# Altium schematic sheet BCK_REVA_2.SchDoc
size A4; SheetNumber: 2; SheetTotal: 3
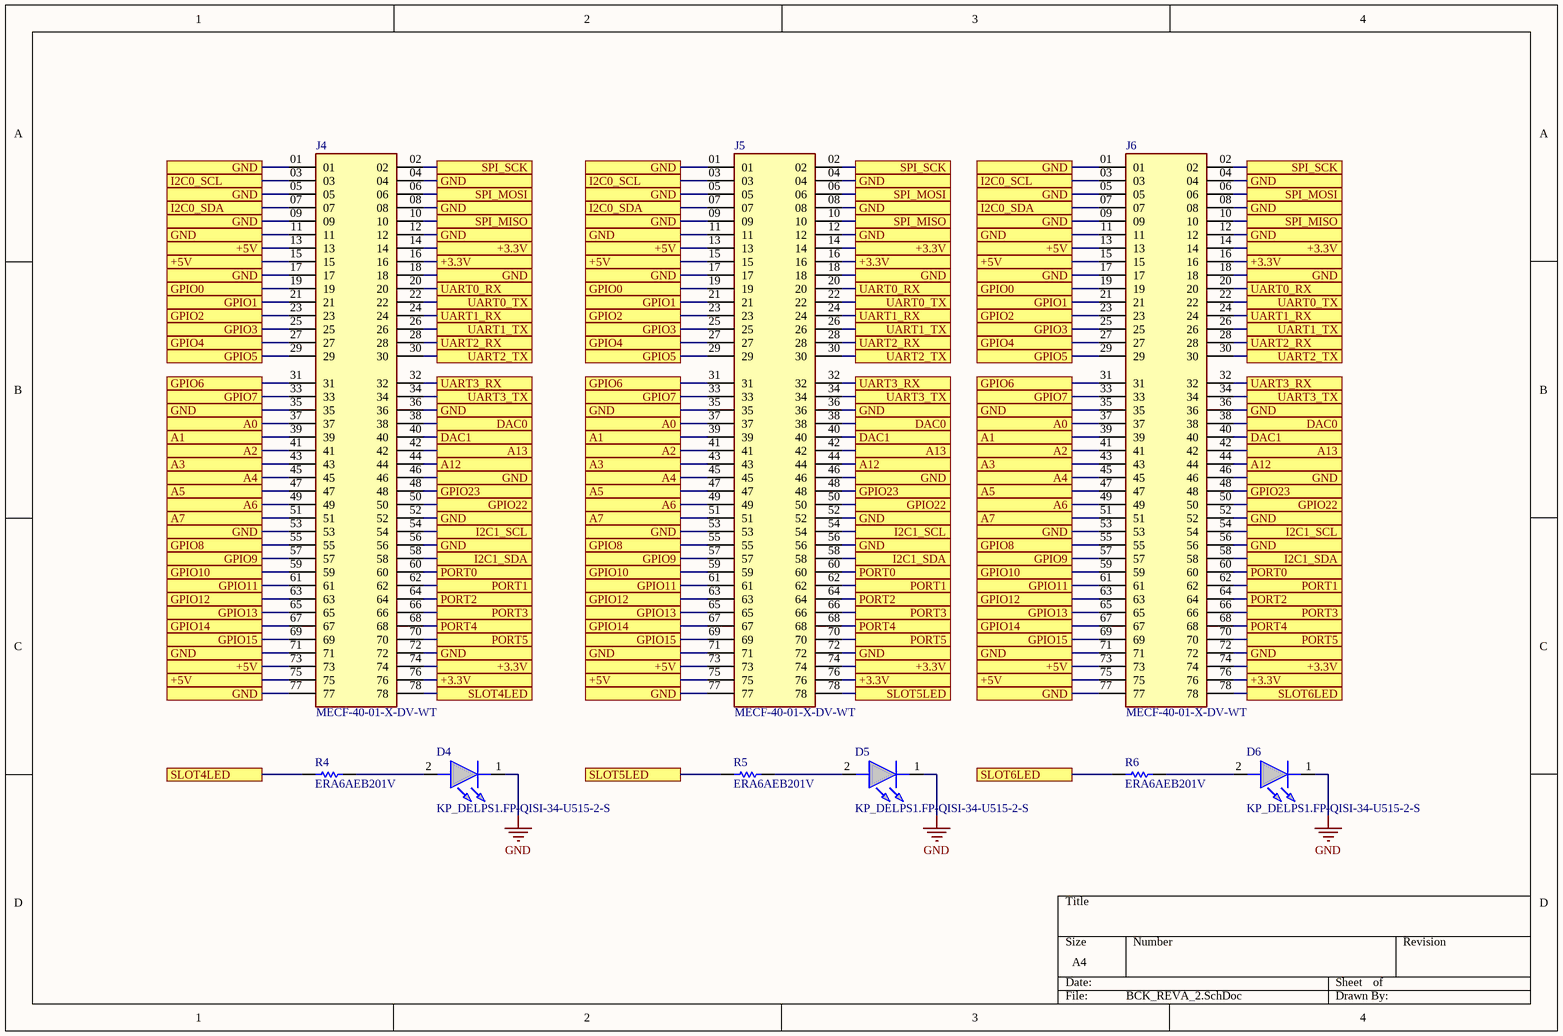
[diagram p0: BCK_REVA_2.SchDoc]

## Parts
D4  KP_DELPS1.FP-QISI-34-U515-2-S  [KPDELPS1FPQISI34U5152S]
D5  KP_DELPS1.FP-QISI-34-U515-2-S  [KPDELPS1FPQISI34U5152S]
D6  KP_DELPS1.FP-QISI-34-U515-2-S  [KPDELPS1FPQISI34U5152S]
J4  MECF-40-01-X-DV-WT  [SAMTEC_MECF-40-01-X-DV-WT]
J5  MECF-40-01-X-DV-WT  [SAMTEC_MECF-40-01-X-DV-WT]
J6  MECF-40-01-X-DV-WT  [SAMTEC_MECF-40-01-X-DV-WT]
R4  ERA6AEB201V  [RESC2013X60X40NL20T25]
R5  ERA6AEB201V  [RESC2013X60X40NL20T25]
R6  ERA6AEB201V  [RESC2013X60X40NL20T25]

## Ports
+3.3V (see BCK_REVA[2A], BCK_REVA[2B], BCK_REVA[2C], BCK_REVA[3A], BCK_REVA[3B], BCK_REVA[3C], BCK_REVA[4A], BCK_REVA[4B], BCK_REVA[4C], BCK_REVA_2[2A], BCK_REVA_2[2B], BCK_REVA_2[2C], BCK_REVA_2[3A], BCK_REVA_2[3B], BCK_REVA_2[3C], BCK_REVA_2[4A], BCK_REVA_2[4B], BCK_REVA_2[4C], BCK_REVA_3[2A], BCK_REVA_3[2B], BCK_REVA_3[2C], BCK_REVA_3[3A], BCK_REVA_3[3B], BCK_REVA_3[3C], BCK_REVA_3[4A], BCK_REVA_3[4B], BCK_REVA_3[4C]), +3.3V (see BCK_REVA[2A], BCK_REVA[2B], BCK_REVA[2C], BCK_REVA[3A], BCK_REVA[3B], BCK_REVA[3C], BCK_REVA[4A], BCK_REVA[4B], BCK_REVA[4C], BCK_REVA_2[2A], BCK_REVA_2[2B], BCK_REVA_2[2C], BCK_REVA_2[3A], BCK_REVA_2[3B], BCK_REVA_2[3C], BCK_REVA_2[4A], BCK_REVA_2[4C], BCK_REVA_3[2A], BCK_REVA_3[2B], BCK_REVA_3[2C], BCK_REVA_3[3A], BCK_REVA_3[3B], BCK_REVA_3[3C], BCK_REVA_3[4A], BCK_REVA_3[4B], BCK_REVA_3[4C]), +3.3V (see BCK_REVA[2A], BCK_REVA[2B], BCK_REVA[2C], BCK_REVA[3A], BCK_REVA[3B], BCK_REVA[3C], BCK_REVA[4A], BCK_REVA[4B], BCK_REVA[4C], BCK_REVA_2[2A], BCK_REVA_2[2B], BCK_REVA_2[2C], BCK_REVA_2[3A], BCK_REVA_2[3B], BCK_REVA_2[3C], BCK_REVA_2[4B], BCK_REVA_2[4C], BCK_REVA_3[2A], BCK_REVA_3[2B], BCK_REVA_3[2C], BCK_REVA_3[3A], BCK_REVA_3[3B], BCK_REVA_3[3C], BCK_REVA_3[4A], BCK_REVA_3[4B], BCK_REVA_3[4C]), +3.3V (see BCK_REVA[2A], BCK_REVA[2B], BCK_REVA[2C], BCK_REVA[3A], BCK_REVA[3B], BCK_REVA[3C], BCK_REVA[4A], BCK_REVA[4B], BCK_REVA[4C], BCK_REVA_2[2A], BCK_REVA_2[2B], BCK_REVA_2[2C], BCK_REVA_2[3A], BCK_REVA_2[3C], BCK_REVA_2[4A], BCK_REVA_2[4B], BCK_REVA_2[4C], BCK_REVA_3[2A], BCK_REVA_3[2B], BCK_REVA_3[2C], BCK_REVA_3[3A], BCK_REVA_3[3B], BCK_REVA_3[3C], BCK_REVA_3[4A], BCK_REVA_3[4B], BCK_REVA_3[4C]), +3.3V (see BCK_REVA[2A], BCK_REVA[2B], BCK_REVA[2C], BCK_REVA[3A], BCK_REVA[3B], BCK_REVA[3C], BCK_REVA[4A], BCK_REVA[4B], BCK_REVA[4C], BCK_REVA_2[2A], BCK_REVA_2[2B], BCK_REVA_2[2C], BCK_REVA_2[3B], BCK_REVA_2[3C], BCK_REVA_2[4A], BCK_REVA_2[4B], BCK_REVA_2[4C], BCK_REVA_3[2A], BCK_REVA_3[2B], BCK_REVA_3[2C], BCK_REVA_3[3A], BCK_REVA_3[3B], BCK_REVA_3[3C], BCK_REVA_3[4A], BCK_REVA_3[4B], BCK_REVA_3[4C]), +3.3V (see BCK_REVA[2A], BCK_REVA[2B], BCK_REVA[2C], BCK_REVA[3A], BCK_REVA[3B], BCK_REVA[3C], BCK_REVA[4A], BCK_REVA[4B], BCK_REVA[4C], BCK_REVA_2[2A], BCK_REVA_2[2C], BCK_REVA_2[3A], BCK_REVA_2[3B], BCK_REVA_2[3C], BCK_REVA_2[4A], BCK_REVA_2[4B], BCK_REVA_2[4C], BCK_REVA_3[2A], BCK_REVA_3[2B], BCK_REVA_3[2C], BCK_REVA_3[3A], BCK_REVA_3[3B], BCK_REVA_3[3C], BCK_REVA_3[4A], BCK_REVA_3[4B], BCK_REVA_3[4C]), +3.3V (see BCK_REVA[2A], BCK_REVA[2B], BCK_REVA[2C], BCK_REVA[3A], BCK_REVA[3B], BCK_REVA[3C], BCK_REVA[4A], BCK_REVA[4B], BCK_REVA[4C], BCK_REVA_2[2B], BCK_REVA_2[2C], BCK_REVA_2[3A], BCK_REVA_2[3B], BCK_REVA_2[3C], BCK_REVA_2[4A], BCK_REVA_2[4B], BCK_REVA_2[4C], BCK_REVA_3[2A], BCK_REVA_3[2B], BCK_REVA_3[2C], BCK_REVA_3[3A], BCK_REVA_3[3B], BCK_REVA_3[3C], BCK_REVA_3[4A], BCK_REVA_3[4B], BCK_REVA_3[4C]), +5V (see BCK_REVA[1A], BCK_REVA[1B], BCK_REVA[1C], BCK_REVA[2A], BCK_REVA[2B], BCK_REVA[2C], BCK_REVA[3A], BCK_REVA[3B], BCK_REVA[3C], BCK_REVA_2[1A], BCK_REVA_2[1B], BCK_REVA_2[1C], BCK_REVA_2[2A], BCK_REVA_2[2B], BCK_REVA_2[2C], BCK_REVA_2[3A], BCK_REVA_2[3B], BCK_REVA_2[3C], BCK_REVA_3[1A], BCK_REVA_3[1B], BCK_REVA_3[1C], BCK_REVA_3[2A], BCK_REVA_3[2B], BCK_REVA_3[2C], BCK_REVA_3[3A], BCK_REVA_3[3B], BCK_REVA_3[3C]), +5V (see BCK_REVA[1A], BCK_REVA[1B], BCK_REVA[1C], BCK_REVA[2A], BCK_REVA[2B], BCK_REVA[2C], BCK_REVA[3A], BCK_REVA[3B], BCK_REVA[3C], BCK_REVA_2[1A], BCK_REVA_2[1B], BCK_REVA_2[1C], BCK_REVA_2[2A], BCK_REVA_2[2B], BCK_REVA_2[2C], BCK_REVA_2[3A], BCK_REVA_2[3C], BCK_REVA_3[1A], BCK_REVA_3[1B], BCK_REVA_3[1C], BCK_REVA_3[2A], BCK_REVA_3[2B], BCK_REVA_3[2C], BCK_REVA_3[3A], BCK_REVA_3[3B], BCK_REVA_3[3C]), +5V (see BCK_REVA[1A], BCK_REVA[1B], BCK_REVA[1C], BCK_REVA[2A], BCK_REVA[2B], BCK_REVA[2C], BCK_REVA[3A], BCK_REVA[3B], BCK_REVA[3C], BCK_REVA_2[1A], BCK_REVA_2[1B], BCK_REVA_2[1C], BCK_REVA_2[2A], BCK_REVA_2[2B], BCK_REVA_2[2C], BCK_REVA_2[3B], BCK_REVA_2[3C], BCK_REVA_3[1A], BCK_REVA_3[1B], BCK_REVA_3[1C], BCK_REVA_3[2A], BCK_REVA_3[2B], BCK_REVA_3[2C], BCK_REVA_3[3A], BCK_REVA_3[3B], BCK_REVA_3[3C]), +5V (see BCK_REVA[1A], BCK_REVA[1B], BCK_REVA[1C], BCK_REVA[2A], BCK_REVA[2B], BCK_REVA[2C], BCK_REVA[3A], BCK_REVA[3B], BCK_REVA[3C], BCK_REVA_2[1A], BCK_REVA_2[1B], BCK_REVA_2[1C], BCK_REVA_2[2A], BCK_REVA_2[2C], BCK_REVA_2[3A], BCK_REVA_2[3B], BCK_REVA_2[3C], BCK_REVA_3[1A], BCK_REVA_3[1B], BCK_REVA_3[1C], BCK_REVA_3[2A], BCK_REVA_3[2B], BCK_REVA_3[2C], BCK_REVA_3[3A], BCK_REVA_3[3B], BCK_REVA_3[3C]), +5V (see BCK_REVA[1A], BCK_REVA[1B], BCK_REVA[1C], BCK_REVA[2A], BCK_REVA[2B], BCK_REVA[2C], BCK_REVA[3A], BCK_REVA[3B], BCK_REVA[3C], BCK_REVA_2[1A], BCK_REVA_2[1B], BCK_REVA_2[1C], BCK_REVA_2[2B], BCK_REVA_2[2C], BCK_REVA_2[3A], BCK_REVA_2[3B], BCK_REVA_2[3C], BCK_REVA_3[1A], BCK_REVA_3[1B], BCK_REVA_3[1C], BCK_REVA_3[2A], BCK_REVA_3[2B], BCK_REVA_3[2C], BCK_REVA_3[3A], BCK_REVA_3[3B], BCK_REVA_3[3C]), +5V (see BCK_REVA[1A], BCK_REVA[1B], BCK_REVA[1C], BCK_REVA[2A], BCK_REVA[2B], BCK_REVA[2C], BCK_REVA[3A], BCK_REVA[3B], BCK_REVA[3C], BCK_REVA_2[1A], BCK_REVA_2[1C], BCK_REVA_2[2A], BCK_REVA_2[2B], BCK_REVA_2[2C], BCK_REVA_2[3A], BCK_REVA_2[3B], BCK_REVA_2[3C], BCK_REVA_3[1A], BCK_REVA_3[1B], BCK_REVA_3[1C], BCK_REVA_3[2A], BCK_REVA_3[2B], BCK_REVA_3[2C], BCK_REVA_3[3A], BCK_REVA_3[3B], BCK_REVA_3[3C]), +5V (see BCK_REVA[1A], BCK_REVA[1B], BCK_REVA[1C], BCK_REVA[2A], BCK_REVA[2B], BCK_REVA[2C], BCK_REVA[3A], BCK_REVA[3B], BCK_REVA[3C], BCK_REVA_2[1B], BCK_REVA_2[1C], BCK_REVA_2[2A], BCK_REVA_2[2B], BCK_REVA_2[2C], BCK_REVA_2[3A], BCK_REVA_2[3B], BCK_REVA_2[3C], BCK_REVA_3[1A], BCK_REVA_3[1B], BCK_REVA_3[1C], BCK_REVA_3[2A], BCK_REVA_3[2B], BCK_REVA_3[2C], BCK_REVA_3[3A], BCK_REVA_3[3B], BCK_REVA_3[3C]), A0 (see BCK_REVA[1B], BCK_REVA[2B], BCK_REVA[3B], BCK_REVA_2[1B], BCK_REVA_2[2B], BCK_REVA_3[1B], BCK_REVA_3[2B], BCK_REVA_3[3B]), A0 (see BCK_REVA[1B], BCK_REVA[2B], BCK_REVA[3B], BCK_REVA_2[1B], BCK_REVA_2[3B], BCK_REVA_3[1B], BCK_REVA_3[2B], BCK_REVA_3[3B]), A0 (see BCK_REVA[1B], BCK_REVA[2B], BCK_REVA[3B], BCK_REVA_2[2B], BCK_REVA_2[3B], BCK_REVA_3[1B], BCK_REVA_3[2B], BCK_REVA_3[3B]), A1 (see BCK_REVA[1B], BCK_REVA[2B], BCK_REVA[3B], BCK_REVA_2[1B], BCK_REVA_2[2B], BCK_REVA_3[1B], BCK_REVA_3[2B], BCK_REVA_3[3B]), A1 (see BCK_REVA[1B], BCK_REVA[2B], BCK_REVA[3B], BCK_REVA_2[1B], BCK_REVA_2[3B], BCK_REVA_3[1B], BCK_REVA_3[2B], BCK_REVA_3[3B]), A1 (see BCK_REVA[1B], BCK_REVA[2B], BCK_REVA[3B], BCK_REVA_2[2B], BCK_REVA_2[3B], BCK_REVA_3[1B], BCK_REVA_3[2B], BCK_REVA_3[3B]), A2 (see BCK_REVA[1B], BCK_REVA[2B], BCK_REVA[3B], BCK_REVA_2[1B], BCK_REVA_2[2B], BCK_REVA_3[1B], BCK_REVA_3[2B], BCK_REVA_3[3B]), A2 (see BCK_REVA[1B], BCK_REVA[2B], BCK_REVA[3B], BCK_REVA_2[1B], BCK_REVA_2[3B], BCK_REVA_3[1B], BCK_REVA_3[2B], BCK_REVA_3[3B]), A2 (see BCK_REVA[1B], BCK_REVA[2B], BCK_REVA[3B], BCK_REVA_2[2B], BCK_REVA_2[3B], BCK_REVA_3[1B], BCK_REVA_3[2B], BCK_REVA_3[3B]), A3 (see BCK_REVA[1B], BCK_REVA[2B], BCK_REVA[3B], BCK_REVA_2[1B], BCK_REVA_2[2B], BCK_REVA_3[1B], BCK_REVA_3[2B], BCK_REVA_3[3B]), A3 (see BCK_REVA[1B], BCK_REVA[2B], BCK_REVA[3B], BCK_REVA_2[1B], BCK_REVA_2[3B], BCK_REVA_3[1B], BCK_REVA_3[2B], BCK_REVA_3[3B]), A3 (see BCK_REVA[1B], BCK_REVA[2B], BCK_REVA[3B], BCK_REVA_2[2B], BCK_REVA_2[3B], BCK_REVA_3[1B], BCK_REVA_3[2B], BCK_REVA_3[3B]), A4 (see BCK_REVA[1B], BCK_REVA[2B], BCK_REVA[3B], BCK_REVA_2[1B], BCK_REVA_2[2B], BCK_REVA_3[1B], BCK_REVA_3[2B], BCK_REVA_3[3B]), A4 (see BCK_REVA[1B], BCK_REVA[2B], BCK_REVA[3B], BCK_REVA_2[1B], BCK_REVA_2[3B], BCK_REVA_3[1B], BCK_REVA_3[2B], BCK_REVA_3[3B]), A4 (see BCK_REVA[1B], BCK_REVA[2B], BCK_REVA[3B], BCK_REVA_2[2B], BCK_REVA_2[3B], BCK_REVA_3[1B], BCK_REVA_3[2B], BCK_REVA_3[3B]), A5 (see BCK_REVA[1B], BCK_REVA[2B], BCK_REVA[3B], BCK_REVA_2[1B], BCK_REVA_2[2B], BCK_REVA_3[1B], BCK_REVA_3[2B], BCK_REVA_3[3B]), A5 (see BCK_REVA[1B], BCK_REVA[2B], BCK_REVA[3B], BCK_REVA_2[1B], BCK_REVA_2[3B], BCK_REVA_3[1B], BCK_REVA_3[2B], BCK_REVA_3[3B]), A5 (see BCK_REVA[1B], BCK_REVA[2B], BCK_REVA[3B], BCK_REVA_2[2B], BCK_REVA_2[3B], BCK_REVA_3[1B], BCK_REVA_3[2B], BCK_REVA_3[3B]), A6 (see BCK_REVA[1B], BCK_REVA[2B], BCK_REVA[3B], BCK_REVA_2[1B], BCK_REVA_2[2B], BCK_REVA_3[1B], BCK_REVA_3[2B], BCK_REVA_3[3B]), A6 (see BCK_REVA[1B], BCK_REVA[2B], BCK_REVA[3B], BCK_REVA_2[1B], BCK_REVA_2[3B], BCK_REVA_3[1B], BCK_REVA_3[2B], BCK_REVA_3[3B]), A6 (see BCK_REVA[1B], BCK_REVA[2B], BCK_REVA[3B], BCK_REVA_2[2B], BCK_REVA_2[3B], BCK_REVA_3[1B], BCK_REVA_3[2B], BCK_REVA_3[3B]), A7 (see BCK_REVA[1C], BCK_REVA[2C], BCK_REVA[3C], BCK_REVA_2[1C], BCK_REVA_2[2C], BCK_REVA_3[1C], BCK_REVA_3[2C], BCK_REVA_3[3C]), A7 (see BCK_REVA[1C], BCK_REVA[2C], BCK_REVA[3C], BCK_REVA_2[1C], BCK_REVA_2[3C], BCK_REVA_3[1C], BCK_REVA_3[2C], BCK_REVA_3[3C]), A7 (see BCK_REVA[1C], BCK_REVA[2C], BCK_REVA[3C], BCK_REVA_2[2C], BCK_REVA_2[3C], BCK_REVA_3[1C], BCK_REVA_3[2C], BCK_REVA_3[3C]), A12 (see BCK_REVA[2B], BCK_REVA[3B], BCK_REVA[4B], BCK_REVA_2[2B], BCK_REVA_2[3B], BCK_REVA_3[2B], BCK_REVA_3[3B], BCK_REVA_3[4B]), A12 (see BCK_REVA[2B], BCK_REVA[3B], BCK_REVA[4B], BCK_REVA_2[2B], BCK_REVA_2[4B], BCK_REVA_3[2B], BCK_REVA_3[3B], BCK_REVA_3[4B]), A12 (see BCK_REVA[2B], BCK_REVA[3B], BCK_REVA[4B], BCK_REVA_2[3B], BCK_REVA_2[4B], BCK_REVA_3[2B], BCK_REVA_3[3B], BCK_REVA_3[4B]), A13 (see BCK_REVA[2B], BCK_REVA[3B], BCK_REVA[4B], BCK_REVA_2[2B], BCK_REVA_2[3B], BCK_REVA_3[2B], BCK_REVA_3[3B], BCK_REVA_3[4B]), A13 (see BCK_REVA[2B], BCK_REVA[3B], BCK_REVA[4B], BCK_REVA_2[2B], BCK_REVA_2[4B], BCK_REVA_3[2B], BCK_REVA_3[3B], BCK_REVA_3[4B]), A13 (see BCK_REVA[2B], BCK_REVA[3B], BCK_REVA[4B], BCK_REVA_2[3B], BCK_REVA_2[4B], BCK_REVA_3[2B], BCK_REVA_3[3B], BCK_REVA_3[4B]), DAC0 (see BCK_REVA[2B], BCK_REVA[3B], BCK_REVA[4B], BCK_REVA_2[2B], BCK_REVA_2[3B], BCK_REVA_3[2B], BCK_REVA_3[3B], BCK_REVA_3[4B]), DAC0 (see BCK_REVA[2B], BCK_REVA[3B], BCK_REVA[4B], BCK_REVA_2[2B], BCK_REVA_2[4B], BCK_REVA_3[2B], BCK_REVA_3[3B], BCK_REVA_3[4B]), DAC0 (see BCK_REVA[2B], BCK_REVA[3B], BCK_REVA[4B], BCK_REVA_2[3B], BCK_REVA_2[4B], BCK_REVA_3[2B], BCK_REVA_3[3B], BCK_REVA_3[4B]), DAC1 (see BCK_REVA[2B], BCK_REVA[3B], BCK_REVA[4B], BCK_REVA_2[2B], BCK_REVA_2[3B], BCK_REVA_3[2B], BCK_REVA_3[3B], BCK_REVA_3[4B]), DAC1 (see BCK_REVA[2B], BCK_REVA[3B], BCK_REVA[4B], BCK_REVA_2[2B], BCK_REVA_2[4B], BCK_REVA_3[2B], BCK_REVA_3[3B], BCK_REVA_3[4B]), DAC1 (see BCK_REVA[2B], BCK_REVA[3B], BCK_REVA[4B], BCK_REVA_2[3B], BCK_REVA_2[4B], BCK_REVA_3[2B], BCK_REVA_3[3B], BCK_REVA_3[4B]), GND (see BCK_REVA[1A], BCK_REVA[1B], BCK_REVA[1C], BCK_REVA[1D], BCK_REVA[2A], BCK_REVA[2B], BCK_REVA[2C], BCK_REVA[3A], BCK_REVA[3B], BCK_REVA[3C], BCK_REVA[4A], BCK_REVA[4B], BCK_REVA[4C], BCK_REVA_2[1A], BCK_REVA_2[1B], BCK_REVA_2[1C], BCK_REVA_2[2A], BCK_REVA_2[2B], BCK_REVA_2[2C], BCK_REVA_2[3A], BCK_REVA_2[3B], BCK_REVA_2[3C], BCK_REVA_2[4A], BCK_REVA_2[4B], BCK_REVA_2[4C], BCK_REVA_3[1A], BCK_REVA_3[1B], BCK_REVA_3[1C], BCK_REVA_3[2A], BCK_REVA_3[2B], BCK_REVA_3[2C], BCK_REVA_3[3A], BCK_REVA_3[3B], BCK_REVA_3[3C], BCK_REVA_3[4A], BCK_REVA_3[4B], BCK_REVA_3[4C]), GPIO0 (see BCK_REVA[1B], BCK_REVA[2B], BCK_REVA[3B], BCK_REVA_2[1B], BCK_REVA_2[2B], BCK_REVA_3[1B], BCK_REVA_3[2B], BCK_REVA_3[3B]), GPIO0 (see BCK_REVA[1B], BCK_REVA[2B], BCK_REVA[3B], BCK_REVA_2[1B], BCK_REVA_2[3B], BCK_REVA_3[1B], BCK_REVA_3[2B], BCK_REVA_3[3B]), GPIO0 (see BCK_REVA[1B], BCK_REVA[2B], BCK_REVA[3B], BCK_REVA_2[2B], BCK_REVA_2[3B], BCK_REVA_3[1B], BCK_REVA_3[2B], BCK_REVA_3[3B]), GPIO1 (see BCK_REVA[1B], BCK_REVA[2B], BCK_REVA[3B], BCK_REVA_2[1B], BCK_REVA_2[2B], BCK_REVA_3[1B], BCK_REVA_3[2B], BCK_REVA_3[3B]), GPIO1 (see BCK_REVA[1B], BCK_REVA[2B], BCK_REVA[3B], BCK_REVA_2[1B], BCK_REVA_2[3B], BCK_REVA_3[1B], BCK_REVA_3[2B], BCK_REVA_3[3B]), GPIO1 (see BCK_REVA[1B], BCK_REVA[2B], BCK_REVA[3B], BCK_REVA_2[2B], BCK_REVA_2[3B], BCK_REVA_3[1B], BCK_REVA_3[2B], BCK_REVA_3[3B]), GPIO2 (see BCK_REVA[1B], BCK_REVA[2B], BCK_REVA[3B], BCK_REVA_2[1B], BCK_REVA_2[2B], BCK_REVA_3[1B], BCK_REVA_3[2B], BCK_REVA_3[3B]), GPIO2 (see BCK_REVA[1B], BCK_REVA[2B], BCK_REVA[3B], BCK_REVA_2[1B], BCK_REVA_2[3B], BCK_REVA_3[1B], BCK_REVA_3[2B], BCK_REVA_3[3B]), GPIO2 (see BCK_REVA[1B], BCK_REVA[2B], BCK_REVA[3B], BCK_REVA_2[2B], BCK_REVA_2[3B], BCK_REVA_3[1B], BCK_REVA_3[2B], BCK_REVA_3[3B]), GPIO3 (see BCK_REVA[1B], BCK_REVA[2B], BCK_REVA[3B], BCK_REVA_2[1B], BCK_REVA_2[2B], BCK_REVA_3[1B], BCK_REVA_3[2B], BCK_REVA_3[3B]), GPIO3 (see BCK_REVA[1B], BCK_REVA[2B], BCK_REVA[3B], BCK_REVA_2[1B], BCK_REVA_2[3B], BCK_REVA_3[1B], BCK_REVA_3[2B], BCK_REVA_3[3B]), GPIO3 (see BCK_REVA[1B], BCK_REVA[2B], BCK_REVA[3B], BCK_REVA_2[2B], BCK_REVA_2[3B], BCK_REVA_3[1B], BCK_REVA_3[2B], BCK_REVA_3[3B]), GPIO4 (see BCK_REVA[1B], BCK_REVA[2B], BCK_REVA[3B], BCK_REVA_2[1B], BCK_REVA_2[2B], BCK_REVA_3[1B], BCK_REVA_3[2B], BCK_REVA_3[3B]), GPIO4 (see BCK_REVA[1B], BCK_REVA[2B], BCK_REVA[3B], BCK_REVA_2[1B], BCK_REVA_2[3B], BCK_REVA_3[1B], BCK_REVA_3[2B], BCK_REVA_3[3B]), GPIO4 (see BCK_REVA[1B], BCK_REVA[2B], BCK_REVA[3B], BCK_REVA_2[2B], BCK_REVA_2[3B], BCK_REVA_3[1B], BCK_REVA_3[2B], BCK_REVA_3[3B]), GPIO5 (see BCK_REVA[1B], BCK_REVA[2B], BCK_REVA[3B], BCK_REVA_2[1B], BCK_REVA_2[2B], BCK_REVA_3[1B], BCK_REVA_3[2B], BCK_REVA_3[3B]), GPIO5 (see BCK_REVA[1B], BCK_REVA[2B], BCK_REVA[3B], BCK_REVA_2[1B], BCK_REVA_2[3B], BCK_REVA_3[1B], BCK_REVA_3[2B], BCK_REVA_3[3B]), GPIO5 (see BCK_REVA[1B], BCK_REVA[2B], BCK_REVA[3B], BCK_REVA_2[2B], BCK_REVA_2[3B], BCK_REVA_3[1B], BCK_REVA_3[2B], BCK_REVA_3[3B]), GPIO6 (see BCK_REVA[1B], BCK_REVA[2B], BCK_REVA[3B], BCK_REVA_2[1B], BCK_REVA_2[2B], BCK_REVA_3[1B], BCK_REVA_3[2B], BCK_REVA_3[3B]), GPIO6 (see BCK_REVA[1B], BCK_REVA[2B], BCK_REVA[3B], BCK_REVA_2[1B], BCK_REVA_2[3B], BCK_REVA_3[1B], BCK_REVA_3[2B], BCK_REVA_3[3B]), GPIO6 (see BCK_REVA[1B], BCK_REVA[2B], BCK_REVA[3B], BCK_REVA_2[2B], BCK_REVA_2[3B], BCK_REVA_3[1B], BCK_REVA_3[2B], BCK_REVA_3[3B]), GPIO7 (see BCK_REVA[1B], BCK_REVA[2B], BCK_REVA[3B], BCK_REVA_2[1B], BCK_REVA_2[2B], BCK_REVA_3[1B], BCK_REVA_3[2B], BCK_REVA_3[3B]), GPIO7 (see BCK_REVA[1B], BCK_REVA[2B], BCK_REVA[3B], BCK_REVA_2[1B], BCK_REVA_2[3B], BCK_REVA_3[1B], BCK_REVA_3[2B], BCK_REVA_3[3B]), GPIO7 (see BCK_REVA[1B], BCK_REVA[2B], BCK_REVA[3B], BCK_REVA_2[2B], BCK_REVA_2[3B], BCK_REVA_3[1B], BCK_REVA_3[2B], BCK_REVA_3[3B]), GPIO8 (see BCK_REVA[1C], BCK_REVA[2C], BCK_REVA[3C], BCK_REVA_2[1C], BCK_REVA_2[2C], BCK_REVA_3[1C], BCK_REVA_3[2C], BCK_REVA_3[3C]), GPIO8 (see BCK_REVA[1C], BCK_REVA[2C], BCK_REVA[3C], BCK_REVA_2[1C], BCK_REVA_2[3C], BCK_REVA_3[1C], BCK_REVA_3[2C], BCK_REVA_3[3C]), GPIO8 (see BCK_REVA[1C], BCK_REVA[2C], BCK_REVA[3C], BCK_REVA_2[2C], BCK_REVA_2[3C], BCK_REVA_3[1C], BCK_REVA_3[2C], BCK_REVA_3[3C]), GPIO9 (see BCK_REVA[1C], BCK_REVA[2C], BCK_REVA[3C], BCK_REVA_2[1C], BCK_REVA_2[2C], BCK_REVA_3[1C], BCK_REVA_3[2C], BCK_REVA_3[3C]), GPIO9 (see BCK_REVA[1C], BCK_REVA[2C], BCK_REVA[3C], BCK_REVA_2[1C], BCK_REVA_2[3C], BCK_REVA_3[1C], BCK_REVA_3[2C], BCK_REVA_3[3C]), GPIO9 (see BCK_REVA[1C], BCK_REVA[2C], BCK_REVA[3C], BCK_REVA_2[2C], BCK_REVA_2[3C], BCK_REVA_3[1C], BCK_REVA_3[2C], BCK_REVA_3[3C]), GPIO10 (see BCK_REVA[1C], BCK_REVA[2C], BCK_REVA[3C], BCK_REVA_2[1C], BCK_REVA_2[2C], BCK_REVA_3[1C], BCK_REVA_3[2C], BCK_REVA_3[3C]), GPIO10 (see BCK_REVA[1C], BCK_REVA[2C], BCK_REVA[3C], BCK_REVA_2[1C], BCK_REVA_2[3C], BCK_REVA_3[1C], BCK_REVA_3[2C], BCK_REVA_3[3C]), GPIO10 (see BCK_REVA[1C], BCK_REVA[2C], BCK_REVA[3C], BCK_REVA_2[2C], BCK_REVA_2[3C], BCK_REVA_3[1C], BCK_REVA_3[2C], BCK_REVA_3[3C]), GPIO11 (see BCK_REVA[1C], BCK_REVA[2C], BCK_REVA[3C], BCK_REVA_2[1C], BCK_REVA_2[2C], BCK_REVA_3[1C], BCK_REVA_3[2C], BCK_REVA_3[3C]), GPIO11 (see BCK_REVA[1C], BCK_REVA[2C], BCK_REVA[3C], BCK_REVA_2[1C], BCK_REVA_2[3C], BCK_REVA_3[1C], BCK_REVA_3[2C], BCK_REVA_3[3C]), GPIO11 (see BCK_REVA[1C], BCK_REVA[2C], BCK_REVA[3C], BCK_REVA_2[2C], BCK_REVA_2[3C], BCK_REVA_3[1C], BCK_REVA_3[2C], BCK_REVA_3[3C]), GPIO12 (see BCK_REVA[1C], BCK_REVA[2C], BCK_REVA[3C], BCK_REVA_2[1C], BCK_REVA_2[2C], BCK_REVA_3[1C], BCK_REVA_3[2C], BCK_REVA_3[3C]), GPIO12 (see BCK_REVA[1C], BCK_REVA[2C], BCK_REVA[3C], BCK_REVA_2[1C], BCK_REVA_2[3C], BCK_REVA_3[1C], BCK_REVA_3[2C], BCK_REVA_3[3C]), GPIO12 (see BCK_REVA[1C], BCK_REVA[2C], BCK_REVA[3C], BCK_REVA_2[2C], BCK_REVA_2[3C], BCK_REVA_3[1C], BCK_REVA_3[2C], BCK_REVA_3[3C]), GPIO13 (see BCK_REVA[1C], BCK_REVA[2C], BCK_REVA[3C], BCK_REVA_2[1C], BCK_REVA_2[2C], BCK_REVA_3[1C], BCK_REVA_3[2C], BCK_REVA_3[3C]), GPIO13 (see BCK_REVA[1C], BCK_REVA[2C], BCK_REVA[3C], BCK_REVA_2[1C], BCK_REVA_2[3C], BCK_REVA_3[1C], BCK_REVA_3[2C], BCK_REVA_3[3C]), GPIO13 (see BCK_REVA[1C], BCK_REVA[2C], BCK_REVA[3C], BCK_REVA_2[2C], BCK_REVA_2[3C], BCK_REVA_3[1C], BCK_REVA_3[2C], BCK_REVA_3[3C]), GPIO14 (see BCK_REVA[1C], BCK_REVA[2C], BCK_REVA[3C], BCK_REVA_2[1C], BCK_REVA_2[2C], BCK_REVA_3[1C], BCK_REVA_3[2C], BCK_REVA_3[3C]), GPIO14 (see BCK_REVA[1C], BCK_REVA[2C], BCK_REVA[3C], BCK_REVA_2[1C], BCK_REVA_2[3C], BCK_REVA_3[1C], BCK_REVA_3[2C], BCK_REVA_3[3C]), GPIO14 (see BCK_REVA[1C], BCK_REVA[2C], BCK_REVA[3C], BCK_REVA_2[2C], BCK_REVA_2[3C], BCK_REVA_3[1C], BCK_REVA_3[2C], BCK_REVA_3[3C]), GPIO15 (see BCK_REVA[1C], BCK_REVA[2C], BCK_REVA[3C], BCK_REVA_2[1C], BCK_REVA_2[2C], BCK_REVA_3[1C], BCK_REVA_3[2C], BCK_REVA_3[3C]), GPIO15 (see BCK_REVA[1C], BCK_REVA[2C], BCK_REVA[3C], BCK_REVA_2[1C], BCK_REVA_2[3C], BCK_REVA_3[1C], BCK_REVA_3[2C], BCK_REVA_3[3C]), GPIO15 (see BCK_REVA[1C], BCK_REVA[2C], BCK_REVA[3C], BCK_REVA_2[2C], BCK_REVA_2[3C], BCK_REVA_3[1C], BCK_REVA_3[2C], BCK_REVA_3[3C]), GPIO22 (see BCK_REVA[2B], BCK_REVA[3B], BCK_REVA[4B], BCK_REVA_2[2B], BCK_REVA_2[3B], BCK_REVA_3[2B], BCK_REVA_3[3B], BCK_REVA_3[4B]), GPIO22 (see BCK_REVA[2B], BCK_REVA[3B], BCK_REVA[4B], BCK_REVA_2[2B], BCK_REVA_2[4B], BCK_REVA_3[2B], BCK_REVA_3[3B], BCK_REVA_3[4B]), GPIO22 (see BCK_REVA[2B], BCK_REVA[3B], BCK_REVA[4B], BCK_REVA_2[3B], BCK_REVA_2[4B], BCK_REVA_3[2B], BCK_REVA_3[3B], BCK_REVA_3[4B]), GPIO23 (see BCK_REVA[2B], BCK_REVA[3B], BCK_REVA[4B], BCK_REVA_2[2B], BCK_REVA_2[3B], BCK_REVA_3[2B], BCK_REVA_3[3B], BCK_REVA_3[4B]), GPIO23 (see BCK_REVA[2B], BCK_REVA[3B], BCK_REVA[4B], BCK_REVA_2[2B], BCK_REVA_2[4B], BCK_REVA_3[2B], BCK_REVA_3[3B], BCK_REVA_3[4B]), GPIO23 (see BCK_REVA[2B], BCK_REVA[3B], BCK_REVA[4B], BCK_REVA_2[3B], BCK_REVA_2[4B], BCK_REVA_3[2B], BCK_REVA_3[3B], BCK_REVA_3[4B]), I2C0_SCL (see BCK_REVA[1A], BCK_REVA[2A], BCK_REVA[3A], BCK_REVA_2[1A], BCK_REVA_2[2A], BCK_REVA_3[1A], BCK_REVA_3[2A], BCK_REVA_3[3A]), I2C0_SCL (see BCK_REVA[1A], BCK_REVA[2A], BCK_REVA[3A], BCK_REVA_2[1A], BCK_REVA_2[3A], BCK_REVA_3[1A], BCK_REVA_3[2A], BCK_REVA_3[3A]), I2C0_SCL (see BCK_REVA[1A], BCK_REVA[2A], BCK_REVA[3A], BCK_REVA_2[2A], BCK_REVA_2[3A], BCK_REVA_3[1A], BCK_REVA_3[2A], BCK_REVA_3[3A]), I2C0_SDA (see BCK_REVA[1A], BCK_REVA[2A], BCK_REVA[3A], BCK_REVA_2[1A], BCK_REVA_2[2A], BCK_REVA_3[1A], BCK_REVA_3[2A], BCK_REVA_3[3A]), I2C0_SDA (see BCK_REVA[1A], BCK_REVA[2A], BCK_REVA[3A], BCK_REVA_2[1A], BCK_REVA_2[3A], BCK_REVA_3[1A], BCK_REVA_3[2A], BCK_REVA_3[3A]), I2C0_SDA (see BCK_REVA[1A], BCK_REVA[2A], BCK_REVA[3A], BCK_REVA_2[2A], BCK_REVA_2[3A], BCK_REVA_3[1A], BCK_REVA_3[2A], BCK_REVA_3[3A]), I2C1_SCL (see BCK_REVA[2C], BCK_REVA[3C], BCK_REVA[4C], BCK_REVA_2[2C], BCK_REVA_2[3C], BCK_REVA_3[2C], BCK_REVA_3[3C], BCK_REVA_3[4C]), I2C1_SCL (see BCK_REVA[2C], BCK_REVA[3C], BCK_REVA[4C], BCK_REVA_2[2C], BCK_REVA_2[4C], BCK_REVA_3[2C], BCK_REVA_3[3C], BCK_REVA_3[4C]), I2C1_SCL (see BCK_REVA[2C], BCK_REVA[3C], BCK_REVA[4C], BCK_REVA_2[3C], BCK_REVA_2[4C], BCK_REVA_3[2C], BCK_REVA_3[3C], BCK_REVA_3[4C]), I2C1_SDA (see BCK_REVA[2C], BCK_REVA[3C], BCK_REVA[4C], BCK_REVA_2[2C], BCK_REVA_2[3C], BCK_REVA_3[2C], BCK_REVA_3[3C], BCK_REVA_3[4C]), I2C1_SDA (see BCK_REVA[2C], BCK_REVA[3C], BCK_REVA[4C], BCK_REVA_2[2C], BCK_REVA_2[4C], BCK_REVA_3[2C], BCK_REVA_3[3C], BCK_REVA_3[4C]), I2C1_SDA (see BCK_REVA[2C], BCK_REVA[3C], BCK_REVA[4C], BCK_REVA_2[3C], BCK_REVA_2[4C], BCK_REVA_3[2C], BCK_REVA_3[3C], BCK_REVA_3[4C]), PORT0 (see BCK_REVA[2C], BCK_REVA[3C], BCK_REVA[4C], BCK_REVA_2[2C], BCK_REVA_2[3C]), PORT0 (see BCK_REVA[2C], BCK_REVA[3C], BCK_REVA[4C], BCK_REVA_2[2C], BCK_REVA_2[4C]), PORT0 (see BCK_REVA[2C], BCK_REVA[3C], BCK_REVA[4C], BCK_REVA_2[3C], BCK_REVA_2[4C]), PORT1 (see BCK_REVA[2C], BCK_REVA[3C], BCK_REVA[4C], BCK_REVA_2[2C], BCK_REVA_2[3C]), PORT1 (see BCK_REVA[2C], BCK_REVA[3C], BCK_REVA[4C], BCK_REVA_2[2C], BCK_REVA_2[4C]), PORT1 (see BCK_REVA[2C], BCK_REVA[3C], BCK_REVA[4C], BCK_REVA_2[3C], BCK_REVA_2[4C]), PORT2 (see BCK_REVA[2C], BCK_REVA[3C], BCK_REVA[4C], BCK_REVA_2[2C], BCK_REVA_2[3C]), PORT2 (see BCK_REVA[2C], BCK_REVA[3C], BCK_REVA[4C], BCK_REVA_2[2C], BCK_REVA_2[4C]), PORT2 (see BCK_REVA[2C], BCK_REVA[3C], BCK_REVA[4C], BCK_REVA_2[3C], BCK_REVA_2[4C]), PORT3 (see BCK_REVA[2C], BCK_REVA[3C], BCK_REVA[4C], BCK_REVA_2[2C], BCK_REVA_2[3C]), PORT3 (see BCK_REVA[2C], BCK_REVA[3C], BCK_REVA[4C], BCK_REVA_2[2C], BCK_REVA_2[4C]), PORT3 (see BCK_REVA[2C], BCK_REVA[3C], BCK_REVA[4C], BCK_REVA_2[3C], BCK_REVA_2[4C]), PORT4 (see BCK_REVA[2C], BCK_REVA[3C], BCK_REVA[4C], BCK_REVA_2[2C], BCK_REVA_2[3C]), PORT4 (see BCK_REVA[2C], BCK_REVA[3C], BCK_REVA[4C], BCK_REVA_2[2C], BCK_REVA_2[4C]), PORT4 (see BCK_REVA[2C], BCK_REVA[3C], BCK_REVA[4C], BCK_REVA_2[3C], BCK_REVA_2[4C]), PORT5 (see BCK_REVA[2C], BCK_REVA[3C], BCK_REVA[4C], BCK_REVA_2[2C], BCK_REVA_2[3C]), PORT5 (see BCK_REVA[2C], BCK_REVA[3C], BCK_REVA[4C], BCK_REVA_2[2C], BCK_REVA_2[4C]), PORT5 (see BCK_REVA[2C], BCK_REVA[3C], BCK_REVA[4C], BCK_REVA_2[3C], BCK_REVA_2[4C]), SLOT4LED (see BCK_REVA_2[1D]), SLOT4LED (see BCK_REVA_2[2C]), SLOT5LED (see BCK_REVA_2[2D]), SLOT5LED (see BCK_REVA_2[3C]), SLOT6LED (see BCK_REVA_2[3D]), SLOT6LED (see BCK_REVA_2[4C]), SPI_MISO (see BCK_REVA[2A], BCK_REVA[3A], BCK_REVA[4A], BCK_REVA_2[2A], BCK_REVA_2[3A], BCK_REVA_3[2A], BCK_REVA_3[3A], BCK_REVA_3[4A]), SPI_MISO (see BCK_REVA[2A], BCK_REVA[3A], BCK_REVA[4A], BCK_REVA_2[2A], BCK_REVA_2[4A], BCK_REVA_3[2A], BCK_REVA_3[3A], BCK_REVA_3[4A]), SPI_MISO (see BCK_REVA[2A], BCK_REVA[3A], BCK_REVA[4A], BCK_REVA_2[3A], BCK_REVA_2[4A], BCK_REVA_3[2A], BCK_REVA_3[3A], BCK_REVA_3[4A]), SPI_MOSI (see BCK_REVA[2A], BCK_REVA[3A], BCK_REVA[4A], BCK_REVA_2[2A], BCK_REVA_2[3A], BCK_REVA_3[2A], BCK_REVA_3[3A], BCK_REVA_3[4A]), SPI_MOSI (see BCK_REVA[2A], BCK_REVA[3A], BCK_REVA[4A], BCK_REVA_2[2A], BCK_REVA_2[4A], BCK_REVA_3[2A], BCK_REVA_3[3A], BCK_REVA_3[4A]), SPI_MOSI (see BCK_REVA[2A], BCK_REVA[3A], BCK_REVA[4A], BCK_REVA_2[3A], BCK_REVA_2[4A], BCK_REVA_3[2A], BCK_REVA_3[3A], BCK_REVA_3[4A]), SPI_SCK (see BCK_REVA[2A], BCK_REVA[3A], BCK_REVA[4A], BCK_REVA_2[2A], BCK_REVA_2[3A], BCK_REVA_3[2A], BCK_REVA_3[3A], BCK_REVA_3[4A]), SPI_SCK (see BCK_REVA[2A], BCK_REVA[3A], BCK_REVA[4A], BCK_REVA_2[2A], BCK_REVA_2[4A], BCK_REVA_3[2A], BCK_REVA_3[3A], BCK_REVA_3[4A]), SPI_SCK (see BCK_REVA[2A], BCK_REVA[3A], BCK_REVA[4A], BCK_REVA_2[3A], BCK_REVA_2[4A], BCK_REVA_3[2A], BCK_REVA_3[3A], BCK_REVA_3[4A]), UART0_RX (see BCK_REVA[2B], BCK_REVA[3B], BCK_REVA[4B], BCK_REVA_2[2B], BCK_REVA_2[3B], BCK_REVA_3[2B], BCK_REVA_3[3B], BCK_REVA_3[4B]), UART0_RX (see BCK_REVA[2B], BCK_REVA[3B], BCK_REVA[4B], BCK_REVA_2[2B], BCK_REVA_2[4B], BCK_REVA_3[2B], BCK_REVA_3[3B], BCK_REVA_3[4B]), UART0_RX (see BCK_REVA[2B], BCK_REVA[3B], BCK_REVA[4B], BCK_REVA_2[3B], BCK_REVA_2[4B], BCK_REVA_3[2B], BCK_REVA_3[3B], BCK_REVA_3[4B]), UART0_TX (see BCK_REVA[2B], BCK_REVA[3B], BCK_REVA[4B], BCK_REVA_2[2B], BCK_REVA_2[3B], BCK_REVA_3[2B], BCK_REVA_3[3B], BCK_REVA_3[4B]), UART0_TX (see BCK_REVA[2B], BCK_REVA[3B], BCK_REVA[4B], BCK_REVA_2[2B], BCK_REVA_2[4B], BCK_REVA_3[2B], BCK_REVA_3[3B], BCK_REVA_3[4B]), UART0_TX (see BCK_REVA[2B], BCK_REVA[3B], BCK_REVA[4B], BCK_REVA_2[3B], BCK_REVA_2[4B], BCK_REVA_3[2B], BCK_REVA_3[3B], BCK_REVA_3[4B]), UART1_RX (see BCK_REVA[2B], BCK_REVA[3B], BCK_REVA[4B], BCK_REVA_2[2B], BCK_REVA_2[3B], BCK_REVA_3[2B], BCK_REVA_3[3B], BCK_REVA_3[4B]), UART1_RX (see BCK_REVA[2B], BCK_REVA[3B], BCK_REVA[4B], BCK_REVA_2[2B], BCK_REVA_2[4B], BCK_REVA_3[2B], BCK_REVA_3[3B], BCK_REVA_3[4B]), UART1_RX (see BCK_REVA[2B], BCK_REVA[3B], BCK_REVA[4B], BCK_REVA_2[3B], BCK_REVA_2[4B], BCK_REVA_3[2B], BCK_REVA_3[3B], BCK_REVA_3[4B]), UART1_TX (see BCK_REVA[2B], BCK_REVA[3B], BCK_REVA[4B], BCK_REVA_2[2B], BCK_REVA_2[3B], BCK_REVA_3[2B], BCK_REVA_3[3B], BCK_REVA_3[4B]), UART1_TX (see BCK_REVA[2B], BCK_REVA[3B], BCK_REVA[4B], BCK_REVA_2[2B], BCK_REVA_2[4B], BCK_REVA_3[2B], BCK_REVA_3[3B], BCK_REVA_3[4B]), UART1_TX (see BCK_REVA[2B], BCK_REVA[3B], BCK_REVA[4B], BCK_REVA_2[3B], BCK_REVA_2[4B], BCK_REVA_3[2B], BCK_REVA_3[3B], BCK_REVA_3[4B]), UART2_RX (see BCK_REVA[2B], BCK_REVA[3B], BCK_REVA[4B], BCK_REVA_2[2B], BCK_REVA_2[3B], BCK_REVA_3[2B], BCK_REVA_3[3B], BCK_REVA_3[4B]), UART2_RX (see BCK_REVA[2B], BCK_REVA[3B], BCK_REVA[4B], BCK_REVA_2[2B], BCK_REVA_2[4B], BCK_REVA_3[2B], BCK_REVA_3[3B], BCK_REVA_3[4B]), UART2_RX (see BCK_REVA[2B], BCK_REVA[3B], BCK_REVA[4B], BCK_REVA_2[3B], BCK_REVA_2[4B], BCK_REVA_3[2B], BCK_REVA_3[3B], BCK_REVA_3[4B]), UART2_TX (see BCK_REVA[2B], BCK_REVA[3B], BCK_REVA[4B], BCK_REVA_2[2B], BCK_REVA_2[3B], BCK_REVA_3[2B], BCK_REVA_3[3B], BCK_REVA_3[4B]), UART2_TX (see BCK_REVA[2B], BCK_REVA[3B], BCK_REVA[4B], BCK_REVA_2[2B], BCK_REVA_2[4B], BCK_REVA_3[2B], BCK_REVA_3[3B], BCK_REVA_3[4B]), UART2_TX (see BCK_REVA[2B], BCK_REVA[3B], BCK_REVA[4B], BCK_REVA_2[3B], BCK_REVA_2[4B], BCK_REVA_3[2B], BCK_REVA_3[3B], BCK_REVA_3[4B]), UART3_RX (see BCK_REVA[2B], BCK_REVA[3B], BCK_REVA[4B], BCK_REVA_2[2B], BCK_REVA_2[3B], BCK_REVA_3[2B], BCK_REVA_3[3B], BCK_REVA_3[4B]), UART3_RX (see BCK_REVA[2B], BCK_REVA[3B], BCK_REVA[4B], BCK_REVA_2[2B], BCK_REVA_2[4B], BCK_REVA_3[2B], BCK_REVA_3[3B], BCK_REVA_3[4B]), UART3_RX (see BCK_REVA[2B], BCK_REVA[3B], BCK_REVA[4B], BCK_REVA_2[3B], BCK_REVA_2[4B], BCK_REVA_3[2B], BCK_REVA_3[3B], BCK_REVA_3[4B]), UART3_TX (see BCK_REVA[2B], BCK_REVA[3B], BCK_REVA[4B], BCK_REVA_2[2B], BCK_REVA_2[3B], BCK_REVA_3[2B], BCK_REVA_3[3B], BCK_REVA_3[4B]), UART3_TX (see BCK_REVA[2B], BCK_REVA[3B], BCK_REVA[4B], BCK_REVA_2[2B], BCK_REVA_2[4B], BCK_REVA_3[2B], BCK_REVA_3[3B], BCK_REVA_3[4B]), UART3_TX (see BCK_REVA[2B], BCK_REVA[3B], BCK_REVA[4B], BCK_REVA_2[3B], BCK_REVA_2[4B], BCK_REVA_3[2B], BCK_REVA_3[3B], BCK_REVA_3[4B])

## Nets
GND: D4.1(K) D5.1(K) D6.1(K)
+3.3V: J4.14 J4.16 J4.74 J4.76 J5.14 J5.16 J5.74 J5.76 J6.14 J6.16 J6.74 J6.76 ; port +3.3V
+5V: J4.13 J4.15 J4.73 J4.75 J5.13 J5.15 J5.73 J5.75 J6.13 J6.15 J6.73 J6.75 ; port +5V
A0: J4.37 J5.37 J6.37 ; port A0
A1: J4.39 J5.39 J6.39 ; port A1
A2: J4.41 J5.41 J6.41 ; port A2
A3: J4.43 J5.43 J6.43 ; port A3
A4: J4.45 J5.45 J6.45 ; port A4
A5: J4.47 J5.47 J6.47 ; port A5
A6: J4.49 J5.49 J6.49 ; port A6
A7: J4.51 J5.51 J6.51 ; port A7
A12: J4.44 J5.44 J6.44 ; port A12
A13: J4.42 J5.42 J6.42 ; port A13
DAC0: J4.38 J5.38 J6.38 ; port DAC0
DAC1: J4.40 J5.40 J6.40 ; port DAC1
GND: J4.01 J4.04 J4.05 J4.08 J4.09 J4.11 J4.12 J4.17 J4.18 J4.35 J4.36 J4.46 J4.52 J4.53 J4.56 J4.71 J4.72 J4.77 J5.01 J5.04 J5.05 J5.08 J5.09 J5.11 J5.12 J5.17 J5.18 J5.35 J5.36 J5.46 J5.52 J5.53 J5.56 J5.71 J5.72 J5.77 J6.01 J6.04 J6.05 J6.08 J6.09 J6.11 J6.12 J6.17 J6.18 J6.35 J6.36 J6.46 J6.52 J6.53 J6.56 J6.71 J6.72 J6.77 ; port GND  [a separate net that carries the same name]
GPIO0: J4.19 J5.19 J6.19 ; port GPIO0
GPIO1: J4.21 J5.21 J6.21 ; port GPIO1
GPIO2: J4.23 J5.23 J6.23 ; port GPIO2
GPIO3: J4.25 J5.25 J6.25 ; port GPIO3
GPIO4: J4.27 J5.27 J6.27 ; port GPIO4
GPIO5: J4.29 J5.29 J6.29 ; port GPIO5
GPIO6: J4.31 J5.31 J6.31 ; port GPIO6
GPIO7: J4.33 J5.33 J6.33 ; port GPIO7
GPIO8: J4.55 J5.55 J6.55 ; port GPIO8
GPIO9: J4.57 J5.57 J6.57 ; port GPIO9
GPIO10: J4.59 J5.59 J6.59 ; port GPIO10
GPIO11: J4.61 J5.61 J6.61 ; port GPIO11
GPIO12: J4.63 J5.63 J6.63 ; port GPIO12
GPIO13: J4.65 J5.65 J6.65 ; port GPIO13
GPIO14: J4.67 J5.67 J6.67 ; port GPIO14
GPIO15: J4.69 J5.69 J6.69 ; port GPIO15
GPIO22: J4.50 J5.50 J6.50 ; port GPIO22
GPIO23: J4.48 J5.48 J6.48 ; port GPIO23
I2C0_SCL: J4.03 J5.03 J6.03 ; port I2C0_SCL
I2C0_SDA: J4.07 J5.07 J6.07 ; port I2C0_SDA
I2C1_SCL: J4.54 J5.54 J6.54 ; port I2C1_SCL
I2C1_SDA: J4.58 J5.58 J6.58 ; port I2C1_SDA
PORT0: J4.60 J5.60 J6.60 ; port PORT0
PORT1: J4.62 J5.62 J6.62 ; port PORT1
PORT2: J4.64 J5.64 J6.64 ; port PORT2
PORT3: J4.66 J5.66 J6.66 ; port PORT3
PORT4: J4.68 J5.68 J6.68 ; port PORT4
PORT5: J4.70 J5.70 J6.70 ; port PORT5
SLOT4LED: J4.78 R4.1 ; port SLOT4LED
SLOT5LED: J5.78 R5.1 ; port SLOT5LED
SLOT6LED: J6.78 R6.1 ; port SLOT6LED
SPI_MISO: J4.10 J5.10 J6.10 ; port SPI_MISO
SPI_MOSI: J4.06 J5.06 J6.06 ; port SPI_MOSI
SPI_SCK: J4.02 J5.02 J6.02 ; port SPI_SCK
UART0_RX: J4.20 J5.20 J6.20 ; port UART0_RX
UART0_TX: J4.22 J5.22 J6.22 ; port UART0_TX
UART1_RX: J4.24 J5.24 J6.24 ; port UART1_RX
UART1_TX: J4.26 J5.26 J6.26 ; port UART1_TX
UART2_RX: J4.28 J5.28 J6.28 ; port UART2_RX
UART2_TX: J4.30 J5.30 J6.30 ; port UART2_TX
UART3_RX: J4.32 J5.32 J6.32 ; port UART3_RX
UART3_TX: J4.34 J5.34 J6.34 ; port UART3_TX
NetD4_2: D4.2(A) R4.2
NetD5_2: D5.2(A) R5.2
NetD6_2: D6.2(A) R6.2

## Library data of the parts
D4-D6 = KP_DELPS1.FP-QISI-34-U515-2-S: High Power LEDs - Single Color Pure Green TOPLED E1608; Manufacturer_Name: AMS OSRAM GROUP; Manufacturer_Part_Number: KP DELPS1.FP-QISI-34-U515-2-S; Geometry.Height: 0.7mm; Mouser Part Number: 720-KPDELPS1FPA0817; Mouser Price/Stock: https://www.mouser.co.uk/ProductDetail/ams-OSRAM/KP-DELPS1FP-QISI-34-U515-2-S?qs=CiayqK2gdcI39hBNO3GmaQ%3D%3D; Arrow Part Number: *; Arrow Price/Stock: *; Mouser Testing Part Number: *; Mouser Testing Price/Stock: *; Datasheet Link: https://www.dialog-semiconductor.com/sites/default/files/2021-09/DA14531_datasheet_3v4.pdf
J4-J6 = MECF-40-01-X-DV-WT: MECF .050" EDGE CARD ASSEMBLY; MF: Samtec; Price: None; MP: MECF-40-01-X-DV-WT; Value: *; Availability: Unavailable; Package: None
R4-R6 = CMP-2001-00608-1: Manufacturer: Panasonic; Part Number: ERA6AEB201V